# EAGLE schematic first_light (EAGLE 9.6.2)
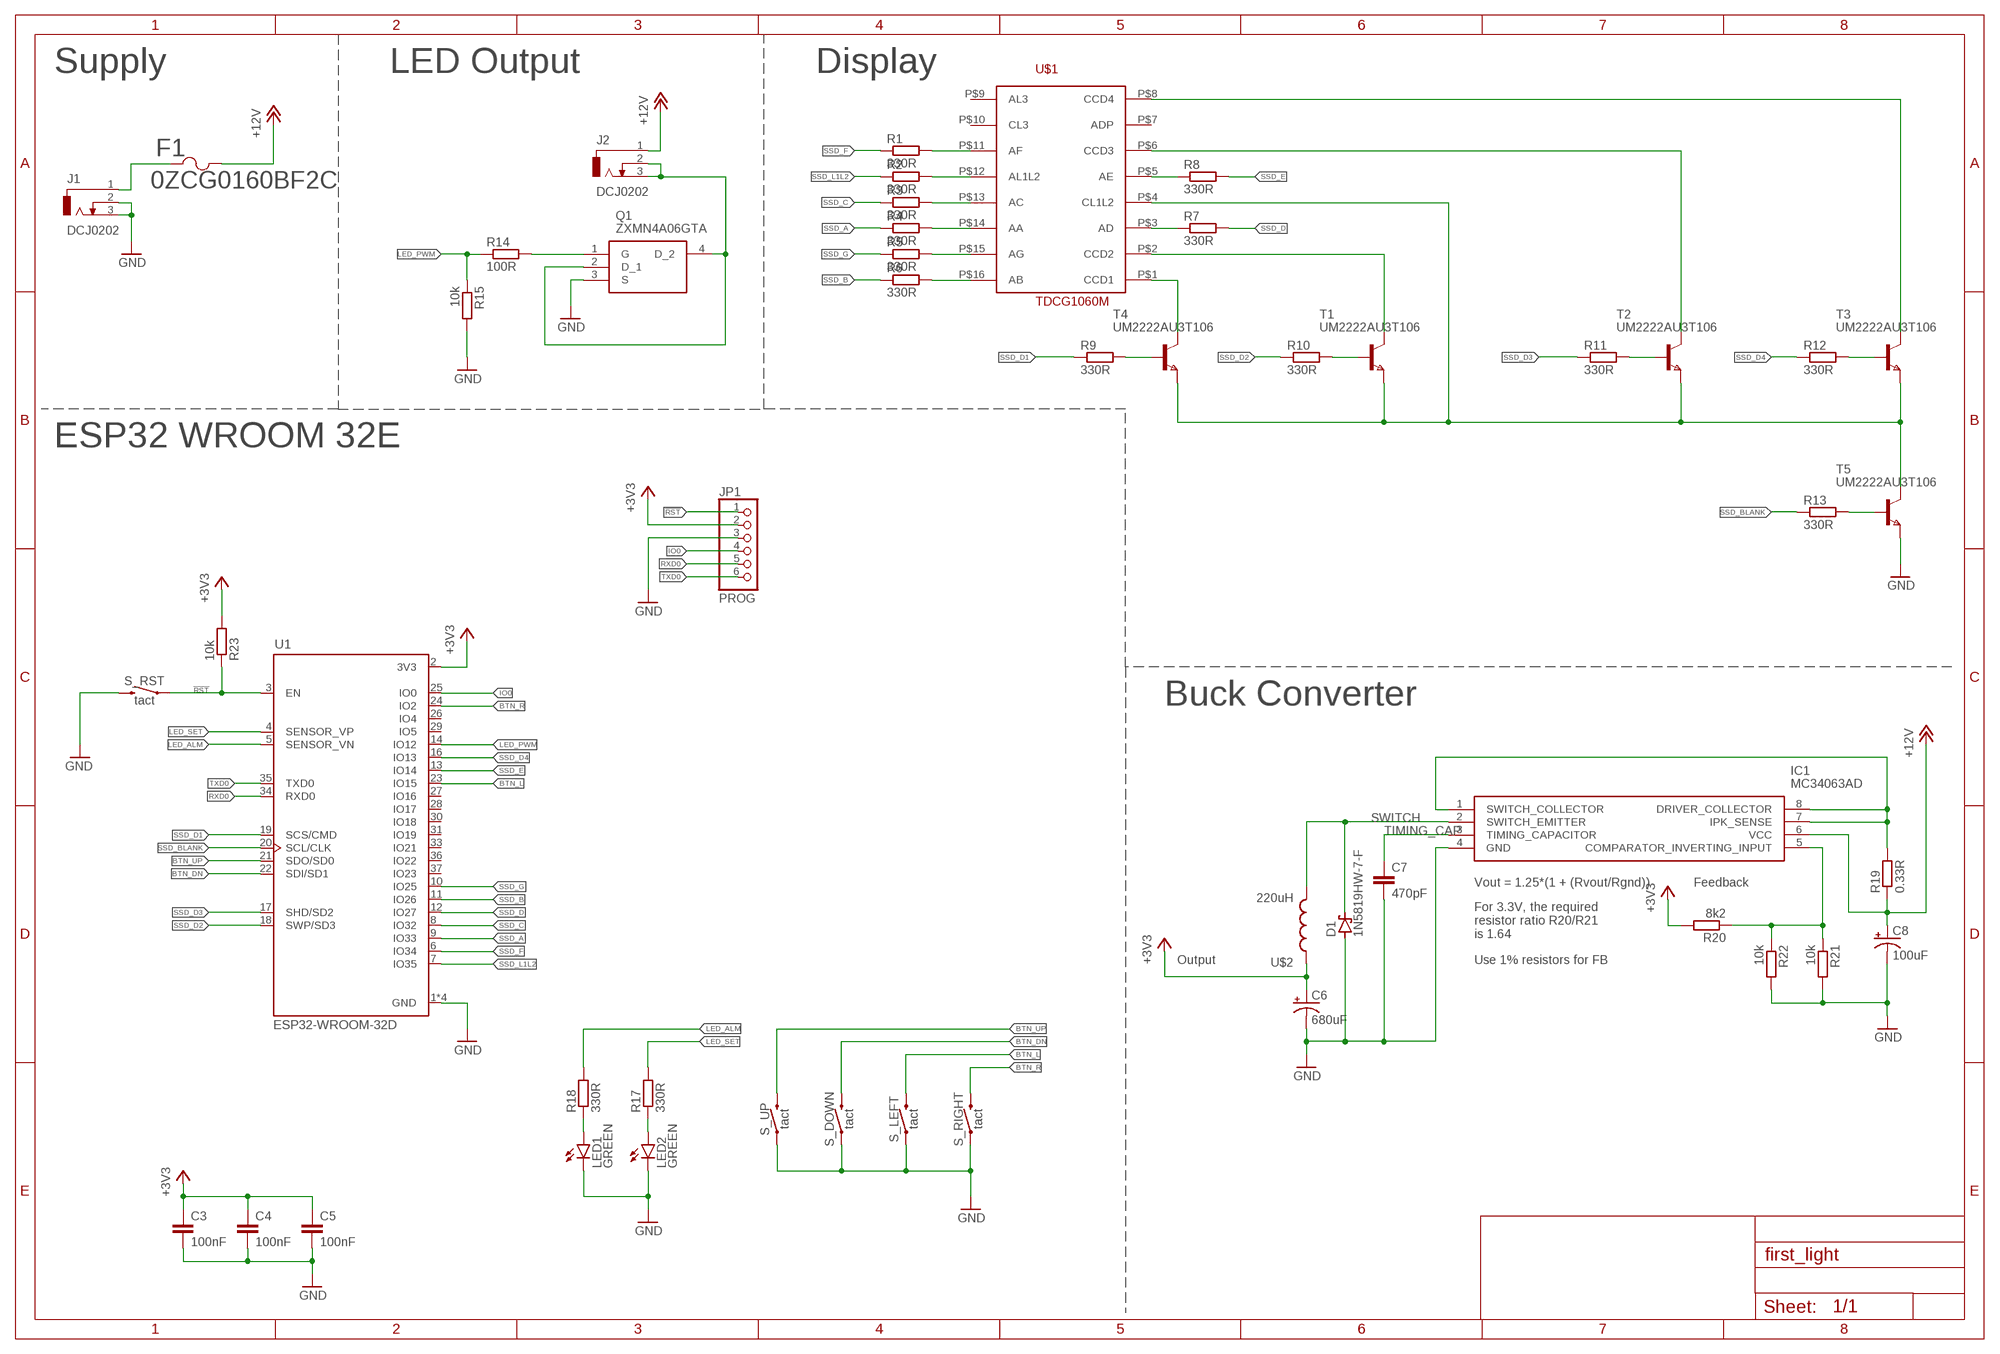
[diagram p0: schematic, sheet 1]

## Parts
C3  100nF  C-EUC0603  [C0603]
C4  100nF  C-EUC0603  [C0603]
C5  100nF  C-EUC0603  [C0603]
C6  680uF  CPOL-US153CLV-0605  [153CLV-0605]
C7  470pF  C-EUC0603  [C0603]
C8  100uF  CPOL-US153CLV-0605  [153CLV-0605]
D1  SCHOTTKY-1N5819HW-7-F  [SOD123]
F1  0ZCG0160BF2C  [0ZCG_BEL]
IC1  MC34063AD  [SOIC127P600X175-8N]
J1  DCJ0202  [DCJ0202]
J2  DCJ0202  [DCJ0202]
JP1  PROG  PINHD-1X6  [1X06]
LED1  GREEN  LEDCHIP-LED0603  [CHIP-LED0603]
LED2  GREEN  LEDCHIP-LED0603  [CHIP-LED0603]
Q1  ZXMN4A06GTA  [SOT230P700X180-4N]
R1  330R  R-EU_R0603  [R0603]
R2  330R  R-EU_R0603  [R0603]
R3  330R  R-EU_R0603  [R0603]
R4  330R  R-EU_R0603  [R0603]
R5  330R  R-EU_R0603  [R0603]
R6  330R  R-EU_R0603  [R0603]
R7  330R  R-EU_R0603  [R0603]
R8  330R  R-EU_R0603  [R0603]
R9  330R  R-EU_R0603  [R0603]
R10  330R  R-EU_R0603  [R0603]
R11  330R  R-EU_R0603  [R0603]
R12  330R  R-EU_R0603  [R0603]
R13  330R  R-EU_R0603  [R0603]
R14  100R  R-EU_R0603  [R0603]
R15  10k  R-EU_R0603  [R0603]
R17  330R  R-EU_R0603  [R0603]
R18  330R  R-EU_R0603  [R0603]
R19  0.33R  R-EU_R0603  [R0603]
R20  8k2  R-EU_R0603  [R0603]
R21  10k  R-EU_R0603  [R0603]
R22  10k  R-EU_R0603  [R0603]
R23  10k  R-EU_R0603  [R0603]
S_DOWN  tact  MOMENTARY-SWITCH-SPST-PTH-6.0MM  [TACTILE_SWITCH_PTH_6.0MM]
S_LEFT  tact  MOMENTARY-SWITCH-SPST-PTH-6.0MM  [TACTILE_SWITCH_PTH_6.0MM]
S_RIGHT  tact  MOMENTARY-SWITCH-SPST-PTH-6.0MM  [TACTILE_SWITCH_PTH_6.0MM]
S_RST  tact  MOMENTARY-SWITCH-SPST-PTH-6.0MM  [TACTILE_SWITCH_PTH_6.0MM]
S_UP  tact  MOMENTARY-SWITCH-SPST-PTH-6.0MM  [TACTILE_SWITCH_PTH_6.0MM]
T1  UM2222AU3T106  NPNSOT323  [SOT323]
T2  UM2222AU3T106  NPNSOT323  [SOT323]
T3  UM2222AU3T106  NPNSOT323  [SOT323]
T4  UM2222AU3T106  NPNSOT323  [SOT323]
T5  UM2222AU3T106  NPNSOT323  [SOT323]
U1  ESP32-WROOM-32D  [MODULE_ESP32-WROOM-32D]
U$1  TDCG1060M  [TDCG1060M]
U$2  220uH  1010_INDUCTOR  [1010_INDUCTOR]

## Nets
!RST: JP1.1 R23.1 S_RST.1 U1.3(EN)
+3V3: C3.1 C4.1 C5.1 C6.+ JP1.2 R20.2 R23.2 U1.2(3V3) U$2.1
+12V: C8.+ F1.2 IC1.6(VCC) J2.1 R19.1
BTN_DN: S_DOWN.3 U1.22(SDI/SD1)
BTN_L: S_LEFT.3 U1.23(IO15)
BTN_R: S_RIGHT.3 U1.24(IO2)
BTN_UP: S_UP.3 U1.21(SDO/SD0)
GND: C3.2 C4.2 C5.2 C6.- C7.2 C8.- D1.2(A) IC1.4(GND) J1.2 J1.3 JP1.3 LED1.C LED2.C Q1.3(S) R15.2 R21.2 R22.2 S_DOWN.1 S_LEFT.1 S_RIGHT.1 S_RST.3 S_UP.1 T5.3(E) U1.1(GND) U1.15(GND) U1.38(GND) U1.39(GND)
IO0: JP1.4 U1.25(IO0)
LED_ALM: R18.2 U1.5(SENSOR_VN)
LED_PWM: R14.1 R15.1 U1.14(IO12)
LED_SET: R17.2 U1.4(SENSOR_VP)
N$1: R1.2 U$1.P$11(AF)
N$2: R2.2 U$1.P$12(AL1L2)
N$3: R3.2 U$1.P$13(AC)
N$4: R4.2 U$1.P$14(AA)
N$5: R5.2 U$1.P$15(AG)
N$6: R6.2 U$1.P$16(AB)
N$7: R7.1 U$1.P$3(AD)
N$8: R8.1 U$1.P$5(AE)
N$9: T4.1(C) U$1.P$1(CCD1)
N$10: T1.1(C) U$1.P$2(CCD2)
N$11: T2.1(C) U$1.P$6(CCD3)
N$12: T3.1(C) U$1.P$8(CCD4)
N$13: T1.3(E) T2.3(E) T3.3(E) T4.3(E) T5.1(C) U$1.P$4(CL1L2)
N$15: R13.2 T5.2(B)
N$16: R12.2 T3.2(B)
N$17: R11.2 T2.2(B)
N$18: R10.2 T1.2(B)
N$19: R9.2 T4.2(B)
N$21: J2.2 J2.3 Q1.2(D_1) Q1.4(D_2)
N$23: Q1.1(G) R14.2
N$24: LED2.A R17.1
N$26: LED1.A R18.1
N$28: IC1.1(SWITCH_COLLECTOR) IC1.7(IPK_SENSE) IC1.8(DRIVER_COLLECTOR) R19.2
N$29: IC1.5(COMPARATOR_INVERTING_INPUT) R20.1 R21.1 R22.1
N$32: F1.1 J1.1
RXD0: JP1.5 U1.34(RXD0)
SSD_A: R4.1 U1.9(IO33)
SSD_B: R6.1 U1.11(IO26)
SSD_BLANK: R13.1 U1.20(SCL/CLK)
SSD_C: R3.1 U1.8(IO32)
SSD_D: R7.2 U1.12(IO27)
SSD_D1: R9.1 U1.19(SCS/CMD)
SSD_D2: R10.1 U1.18(SWP/SD3)
SSD_D3: R11.1 U1.17(SHD/SD2)
SSD_D4: R12.1 U1.16(IO13)
SSD_E: R8.2 U1.13(IO14)
SSD_F: R1.1 U1.6(IO34)
SSD_G: R5.1 U1.10(IO25)
SSD_L1L2: R2.1 U1.7(IO35)
SWITCH: D1.1(C) IC1.2(SWITCH_EMITTER) U$2.2
TIMING_CAP: C7.1 IC1.3(TIMING_CAPACITOR)
TXD0: JP1.6 U1.35(TXD0)
Unconnected: U1.26(IO4) U1.27(IO16) U1.28(IO17) U1.29(IO5) U1.30(IO18) U1.31(IO19) U1.33(IO21) U1.36(IO22) U1.37(IO23) U$1.P$7(ADP) U$1.P$9(AL3) U$1.P$10(CL3)

## Notes on the sheet
- Supply | LED Output | Display
- ESP32 WROOM 32E
- Buck Converter
- Vout = 1.25*(1 + (Rvout/Rgnd)) | Feedback
- For 3.3V, the required
  resistor ratio R20/R21
  is 1.64
- Output | Use 1% resistors for FB

## Library data of the parts
C3-C5 = rcl:C-EU: CAPACITOR, European symbol; DKPN: 1276-1935-1-ND; MFPN: CL10B104KB8NNWC; SPICEPREFIX: C
C6 = rcl:CPOL-US: POLARIZED CAPACITOR, American symbol; DKPN: 565-5128-1-ND; MFPN: EMZR6R3ARA681MF80G; SPICEPREFIX: C
C7 = rcl:C-EU: CAPACITOR, European symbol; DKPN: 1276-1094-1-ND; MFPN: CL10B471KB8NNNC; SPICEPREFIX: C
C8 = rcl:CPOL-US: POLARIZED CAPACITOR, American symbol; DKPN: 2616-VE-101M1CTR-0605S-ND; MFPN: VE-101M1CTR-0605S; SPICEPREFIX: C
D1 = Schottky-1N5819HW-7-F:SCHOTTKY-1N5819HW-7-F; DKPN: 1N5819HW-FDICT-ND; MFPN: 1N5819HW-7-F
F1 = 0ZCG0160BF2C:0ZCG0160BF2C; COPYRIGHT: Copyright (C) 2021 Ultra Librarian. All rights reserved.; DKPN: 507-1776-1-ND; MANUFACTURER_PART_NUMBER: 0ZCG0160BF2C; MFPN: 0ZCG0160BF2C; MFR_NAME: Belfuse
IC1 = MC34063AD:MC34063AD: Step up/down converter,MC34063AD 98pcs Source: Datasheet <http://www.onsemi.com/pub/Collateral/MC34063A-D.PDF>; ARROW_PART_NUMBER: MC34063AD; ARROW_PRICE-STOCK: https://www.arrow.com/en/products/mc34063ad/on-semiconductor; DESCRIPTION: Step up/down converter,MC34063AD 98pcs; DKPN: MC34063ADR2GOSCT-ND; HEIGHT: 1.75mm; MANUFACTURER_NAME: ON Semiconductor; MANUFACTURER_PART_NUMBER: MC34063AD; MFPN: MC34063ADR2G; MOUSER_PART_NUMBER: 512-MC34063AD; MOUSER_PRICE-STOCK: http://www.mouser.com/Search/ProductDetail.aspx?qs=qJQOsIEC8WHIuBHtgH5ZSQ%3d%3d
J1 J2 = con-jack:DCJ0202: DC POWER JACK Source: DCJ0202.pdf; DKPN: 2092-KLDX-0202-BC-ND; MFPN: KLDX-0202-BC; OC_FARNELL: unknown; OC_NEWARK: unknown
JP1 = pinhead:PINHD-1X6: PIN HEADER
LED1 LED2 = led:LED: LED OSRAM: - CHIPLED LG R971, LG N971, LY N971, LG Q971, LY Q971, LO R971, LY R971 LH N974, LH R974 LS Q976, LO Q976, LY Q976 LO Q996 - Hyper CHIPLED LW Q18S LB Q993, LB Q99A, LB R99A - SideLED LS A670, LO A670, LY A670, LG A670, LP A670 LB A673, LV A673, LT A673, LW A673 LH A674 LY A675 LS A676, LA A676, LO A676, LY A676, LW A676 LS A679, LY A679, LG A679 - Hyper Micro SIDELED® LS Y876, LA Y876, LO Y876, LY Y876 LT Y87S - SmartLED LW L88C, LW L88S LB L89C, LB L89S, LG L890 LS L89K, LO L89K, LY L89K LS L896, LA L896, LO L896, LY L896 - TOPLED LS T670, LO T670, LY T670, LG T670, LP T670 LSG T670, LSP T670, LSY T670, LOP T670, LYG T670 LG T671, LOG T671, LSG T671 LB T673, LV T673, LT T673, LW T673 LH T674 LS T676, LA T676, LO T676, LY T676, LB T676, LH T676, LSB T676, LW T676 LB T67C, LV T67C, LT T67C, LS T67K, LO T67K, LY T67K, LW E67C LS E67B, LA E67B, LO E67B, LY E67B, LB E67C, LV E67C, LT E67C LW T67C LS T679, LY T679, LG T679 LS T770, LO T770, LY T770, LG T770, LP T770 LB T773, LV T773, LT T773, LW T773 LH T774 LS E675, LA E675, LY E675, LS T675 LS T776, LA T776, LO T776, LY T776, LB T776 LHGB T686 LT T68C, LB T68C - Hyper Mini TOPLED® LB M676 - Mini TOPLED Santana® LG M470 LS M47K, LO M47K, LY M47K Source: http://www.osram.convergy.de LUXEON: - LUMILED® LXK2-PW12-R00, LXK2-PW12-S00, LXK2-PW14-U00, LXK2-PW14-V00 LXK2-PM12-R00, LXK2-PM12-S00, LXK2-PM14-U00 LXK2-PE12-Q00, LXK2-PE12-R00, LXK2-PE12-S00, LXK2-PE14-T00, LXK2-PE14-U00 LXK2-PB12-K00, LXK2-PB12-L00, LXK2-PB12-M00, LXK2-PB14-N00, LXK2-PB14-P00, LXK2-PB14-Q00 LXK2-PR12-L00, LXK2-PR12-M00, LXK2-PR14-Q00, LXK2-PR14-R00 LXK2-PD12-Q00, LXK2-PD12-R00, LXK2-PD12-S00 LXK2-PH12-R00, LXK2-PH12-S00 LXK2-PL12-P00, LXK2-PL12-Q00, LXK2-PL12-R00 Source: www.luxeon.com KINGBRIGHT: KA-3528ASYC Source: www.kingbright.com; DKPN: 732-4980-1-ND; MFPN: 150060VS75000
Q1 = ZXMN4A06GTA:ZXMN4A06GTA: MOSFET 40V N-Chnl UMOS Source: Datasheet <https://www.diodes.com/assets/Datasheets/ZXMN4A06G.pdf>; ARROW_PART_NUMBER: ZXMN4A06GTA; ARROW_PRICE-STOCK: https://www.arrow.com/en/products/zxmn4a06gta/diodes-incorporated?region=nac; DESCRIPTION: MOSFET 40V N-Chnl UMOS; DKPN: ZXMN4A06GCT-ND; HEIGHT: 1.8mm; MANUFACTURER_NAME: Diodes Inc.; MANUFACTURER_PART_NUMBER: ZXMN4A06GTA; MFPN: ZXMN4A06GTA; MOUSER_PART_NUMBER: 522-ZXMN4A06GTA; MOUSER_PRICE-STOCK: https://www.mouser.co.uk/ProductDetail/Diodes-Incorporated/ZXMN4A06GTA?qs=rI7uf1IzohTuiF7NiXeyvA%3D%3D
R1-R13 R17 R18 = rcl:R-EU_: RESISTOR, European symbol; DKPN: 311-330GRCT-ND; MFPN: RC0603JR-07330RL; SPICEPREFIX: R
R14 = rcl:R-EU_: RESISTOR, European symbol; DKPN: 311-100GRCT-ND; MFPN: RC0603JR-07100RL; SPICEPREFIX: R
R15 R21-R23 = rcl:R-EU_: RESISTOR, European symbol; DKPN: 13-RC0603JR-1010KLCT-ND; MFPN: RC0603JR-1010KL; SPICEPREFIX: R
R19 = rcl:R-EU_: RESISTOR, European symbol; DKPN: P17485CT-ND; MFPN: ERJ-3BWJR033V; SPICEPREFIX: R
R20 = rcl:R-EU_: RESISTOR, European symbol; DKPN: 311-8.2KGRCT-ND; MFPN: RC0603JR-078K2L; SPICEPREFIX: R
S_DOWN S_LEFT S_RIGHT S_RST S_UP = SparkFun-Switches:MOMENTARY-SWITCH-SPST: Momentary Switch (Pushbutton) - SPST Normally-open (NO) SPST momentary switches (buttons, pushbuttons). Variants PTH-12MM - 12mm square, through-hole Momentary Pushbutton Switch - 12mm Square <https://www.sparkfun.com/products/9190> (COM-09190) PTH-6.0MM, PTH-6.0MM-KIT - 6.0mm square, through-hole Mini Pushbutton Switch <https://www.sparkfun.com/products/97> (COM-00097) KIT package intended for soldering kit's - only one side of pads' copper is exposed. PTH-RIGHT-ANGLE-KIT - Right-angle, through-hole Right Angle Tactile Button <https://www.sparkfun.com/products/10791> - Used on SparkFun BigTime Watch Kit <https://www.sparkfun.com/products/11734> SMD-12MM - 12mm square, surface-mount Tactile Button - SMD (12mm) <https://www.sparkfun.com/products/12993> (COM-12993) Used on SparkFun PicoBoard <https://www.sparkfun.com/products/11888> SMD-4.5MM - 4.5mm Square Trackball Switch Used on SparkFun Blackberry Trackballer Breakout <https://www.sparkfun.com/products/13169> SMD-4.6MMX2.8MM - 4.60mm x 2.80mm, surface mount Used on SparkFun SAMD21 Mini Breakout <https://www.sparkfun.com/products/13664> SMD-5.2MM, SMD-5.2-REDUNDANT - 5.2mm square, surface-mount Mini Pushbutton Switch - SMD <https://www.sparkfun.com/products/8720> (COM-08720) Used on Arduino Pro Mini <https://www.sparkfun.com/products/11114> REDUNDANT package connects both switch circuits together SMD-6.0X3.5MM - 6.0 x 3.5mm, surface mount Momentary Reset Switch SMD <https://www.sparkfun.com/products/8229> (COM-08229) SMD-6.2MM-TALL - 6.2mm square, surface mount Tactile Button - SMD (6mm) <https://www.sparkfun.com/products/12992> Used on SparkFun Digital Sandbox <https://www.sparkfun.com/products/12651> SMD-RIGHT-ANGLE - Right-angle, surface mount Used on SparkFun Block for Intel® Edison - Arduino <https://www.sparkfun.com/products/13036>; DKPN: 2223-TS02-66-60-BK-100-LCR-D-ND; MFPN: TS02-66-60-BK-100-LCR-D; PROD_ID: SWCH-08441; SF_SKU: COM-00097
T1-T5 = zetex:NPNSOT323: NPN TRANSISTOR; DKPN: 846-UM2222AU3T106CT-ND; MFPN: UM2222AU3T106; MPN: DSS4160U-7; OC_FARNELL: 1710696; OC_NEWARK: 25R4558
U1 = ESP32-WROOM-32D:ESP32-WROOM-32D: IC: SoC; GPIO, I2C, I2S, IR, SD, SDIO, SPI, UART; 2.7÷3.6VDC; 20dBm; AVAILABILITY: Unavailable; DESCRIPTION: IC: SoC; GPIO, I2C, I2S, IR, SD, SDIO, SPI, UART; 2.7÷3.6VDC; 20dBm; DKPN: 1965-ESP32-WROOM-32E-H4CT-ND; MF: Espressif Systems; MFPN: ESP32-WROOM-32E-H4; MP: ESP32-WROOM-32D; PACKAGE: Module Espressif Systems; PRICE: None
U$1 = TDCG1060M:TDCG1060M; DKPN: TDCG1060M-ND; MFPN: TDCG1060M
U$2 = 1010_INDUCTOR:1010_INDUCTOR; DKPN: 732-4110-1-ND; MFPN: 7447714221